# Altium schematic sheet Sheet1.SchDoc
size A4
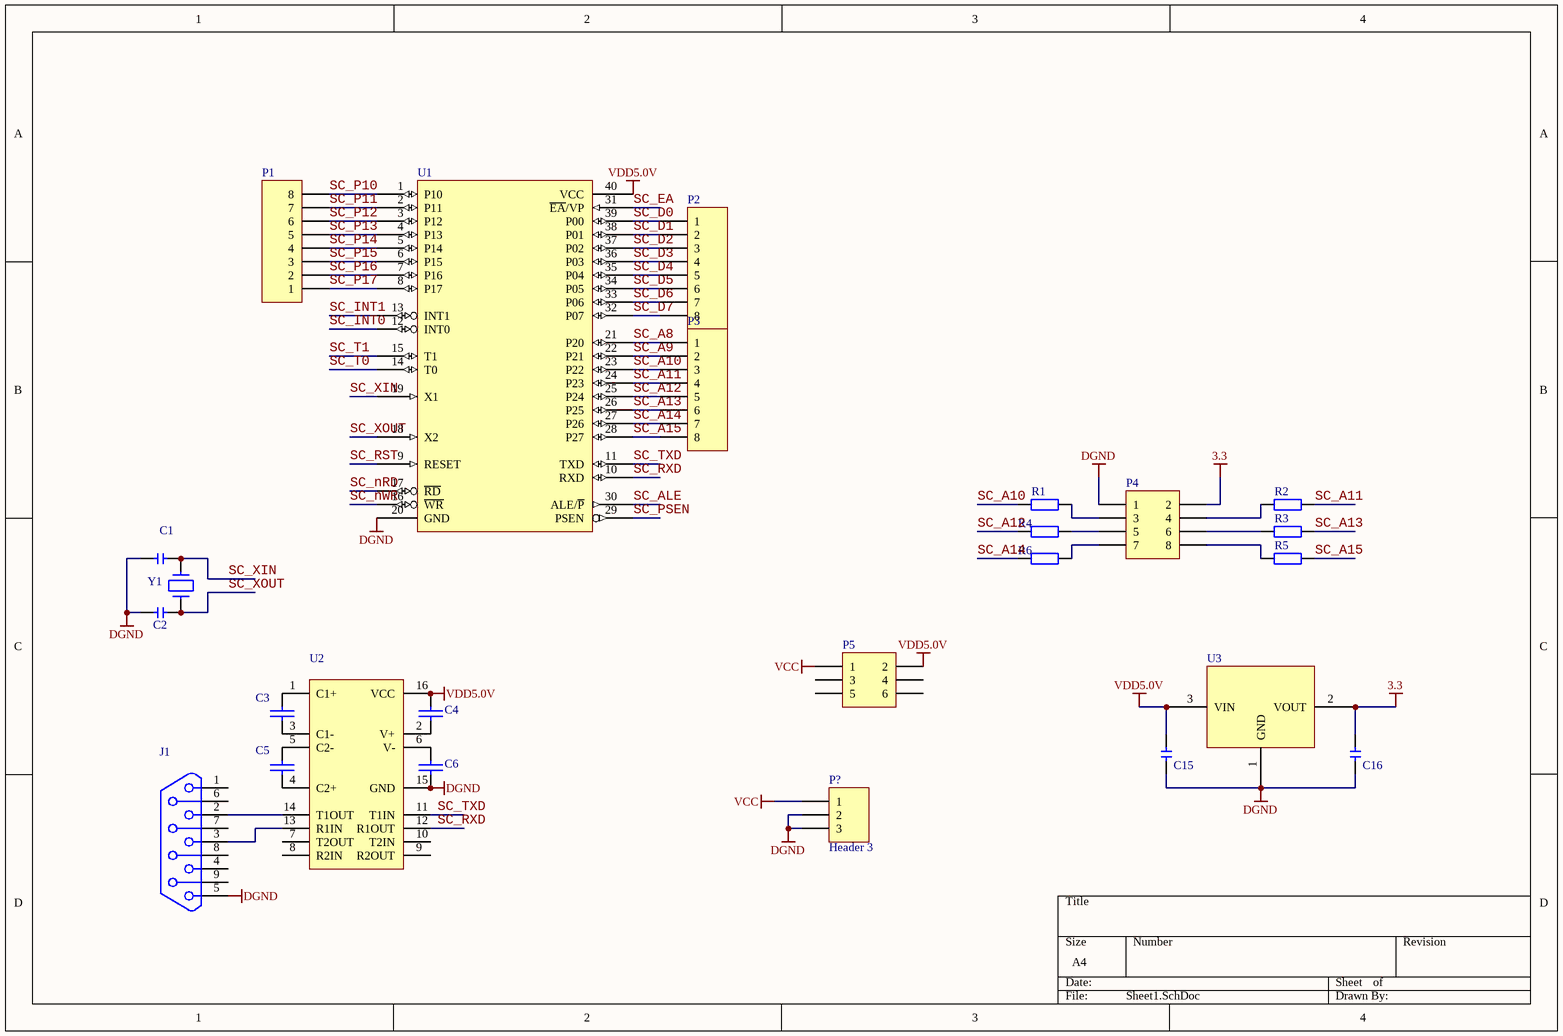
[diagram p0: Sheet1.SchDoc]

## Parts
C1  33pF  [c0.2]  (value not drawn)
C2  33pF  [c0.2]  (value not drawn)
C3  0.1uF  [C0.2]  (value not drawn)
C4  0.1uF  [C0.2]  (value not drawn)
C5  0.1uF  [C0.2]  (value not drawn)
C6  0.1uF  [C0.2]  (value not drawn)
C15  33pF  [c0.2]  (value not drawn)
C16  33pF  [c0.2]  (value not drawn)
J1  DB9  [RS232]  (value not drawn)
P1  Header 8  [HDR1X8]  (value not drawn)
P2  Header 8  [HDR1X8]  (value not drawn)
P3  Header 8  [HDR1X8]  (value not drawn)
P4  Header 4X2  [HDR2X4]  (value not drawn)
P5  Header 3X2  [KZ]  (value not drawn)
P?  Header 3  [Power_In]
R1  Res2  [AXIAL-0.4]  (value not drawn)
R2  Res2  [AXIAL-0.4]  (value not drawn)
R3  Res2  [AXIAL-0.4]  (value not drawn)
R4  Res2  [AXIAL-0.4]  (value not drawn)
R5  Res2  [AXIAL-0.4]  (value not drawn)
R6  Res2  [AXIAL-0.4]  (value not drawn)
U1  8031  [DIP40]  (value not drawn)
U2  MAX232-2  [DIP16]  (value not drawn)
U3  AMS1117  [SOT223]  (value not drawn)
Y1  11.0596MHz  [XTAL-1]  (value not drawn)

## Nets
3.3: C16.2 P4.2 U3.2(VOUT)
DGND: C1.1 C2.1 C6.2 C15.1 C16.1 J1.5 P4.1 P?.2 P?.3 U1.20(GND) U2.15(GND) U3.1(GND)
VCC: P5.1 P?.1
VDD5.0V: C4.1 C15.2 P5.2 U1.40(VCC) U2.16(VCC) U3.3(VIN)
SC_A8: P3.1 U1.21(P20)
SC_A9: P3.2 U1.22(P21)
SC_A10: P3.3 R1.1 U1.23(P22)
SC_A11: P3.4 R2.2 U1.24(P23)
SC_A12: P3.5 R4.1 U1.25(P24)
SC_A13: P3.6 R3.2 U1.26(P25)
SC_A14: P3.7 R6.1 U1.27(P26)
SC_A15: P3.8 R5.2 U1.28(P27)
SC_ALE: U1.30(ALE/~{P})
SC_D0: P2.1 U1.39(P00)
SC_D1: P2.2 U1.38(P01)
SC_D2: P2.3 U1.37(P02)
SC_D3: P2.4 U1.36(P03)
SC_D4: P2.5 U1.35(P04)
SC_D5: P2.6 U1.34(P05)
SC_D6: P2.7 U1.33(P06)
SC_D7: P2.8 U1.32(P07)
SC_EA: U1.31(~{EA}/VP)
SC_INT0: U1.12(INT0)
SC_INT1: U1.13(INT1)
SC_nRD: U1.17(~{RD})
SC_nWR: U1.16(~{WR})
SC_P10: P1.8 U1.1(P10)
SC_P11: P1.7 U1.2(P11)
SC_P12: P1.6 U1.3(P12)
SC_P13: P1.5 U1.4(P13)
SC_P14: P1.4 U1.5(P14)
SC_P15: P1.3 U1.6(P15)
SC_P16: P1.2 U1.7(P16)
SC_P17: P1.1 U1.8(P17)
SC_PSEN: U1.29(PSEN)
SC_RST: U1.9(RESET)
SC_RXD: U1.10(RXD) U2.12(R1OUT)
SC_T0: U1.14(T0)
SC_T1: U1.15(T1)
SC_TXD: U1.11(TXD) U2.11(T1IN)
SC_XIN: C1.2 U1.19(X1) Y1.2
SC_XOUT: C2.2 U1.18(X2) Y1.1
NetC3_1: C3.1 U2.1(C1+)
NetC3_2: C3.2 U2.3(C1-)
NetC4_2: C4.2 U2.2(V+)
NetC5_1: C5.1 U2.5(C2-)
NetC5_2: C5.2 U2.4(C2+)
NetC6_1: C6.1 U2.6(V-)
NetJ1_2: J1.2 U2.14(T1OUT)
NetJ1_3: J1.3 U2.13(R1IN)
NetP4_3: P4.3 R1.2
NetP4_4: P4.4 R2.1
NetP4_5: P4.5 R4.2
NetP4_6: P4.6 R3.1
NetP4_7: P4.7 R6.2
NetP4_8: P4.8 R5.1

Not connected (* = marked no-connect by the designer): J1 1 4 6 7 8 9; P5 3 4 5 6; U2 7(T2OUT) 8(R2IN) 9(R2OUT) 10(T2IN)

## Library data of the parts
C1-C6 C15 C16 = CAP: Capacitor
P1-P3 = Header 8: Header, 8-Pin; LatestRevisionDate: 17-Jul-2002; LatestRevisionNote: Re-released for DXP Platform.; Publisher: Altium Limited
P4 = Header 4X2: Header, 4-Pin, Dual row; LatestRevisionDate: 17-Jul-2002; LatestRevisionNote: Re-released for DXP Platform.; Publisher: Altium Limited
P5 = Header 3X2: Header, 3-Pin, Dual row; LatestRevisionDate: 17-Jul-2002; LatestRevisionNote: Re-released for DXP Platform.; Publisher: Altium Limited
P? = Header 3: Header, 3-Pin; LatestRevisionDate: 17-Jul-2002; LatestRevisionNote: Re-released for DXP Platform.; Publisher: Altium Limited
R1-R6 = Res2: Resistor; Value: 1K; Published: 8-Jun-2000; LatestRevisionDate: 17-Jul-2002; LatestRevisionNote: Re-released for DXP Platform.; PackageReference: AXIAL-0.4; Publisher: Altium Limited
U2 = MAX3232-2
U3 = COMPONENT_2
Y1 = CRYSTAL